# Altium schematic sheet main.SchDoc: TinyProbe Power Fix PCB
size A4; DrawnBy: Sergei Vostrikov; Organization: Integrated Systems Laboratory; Revision: v1.0.0; SheetNumber: 1; SheetTotal: 1
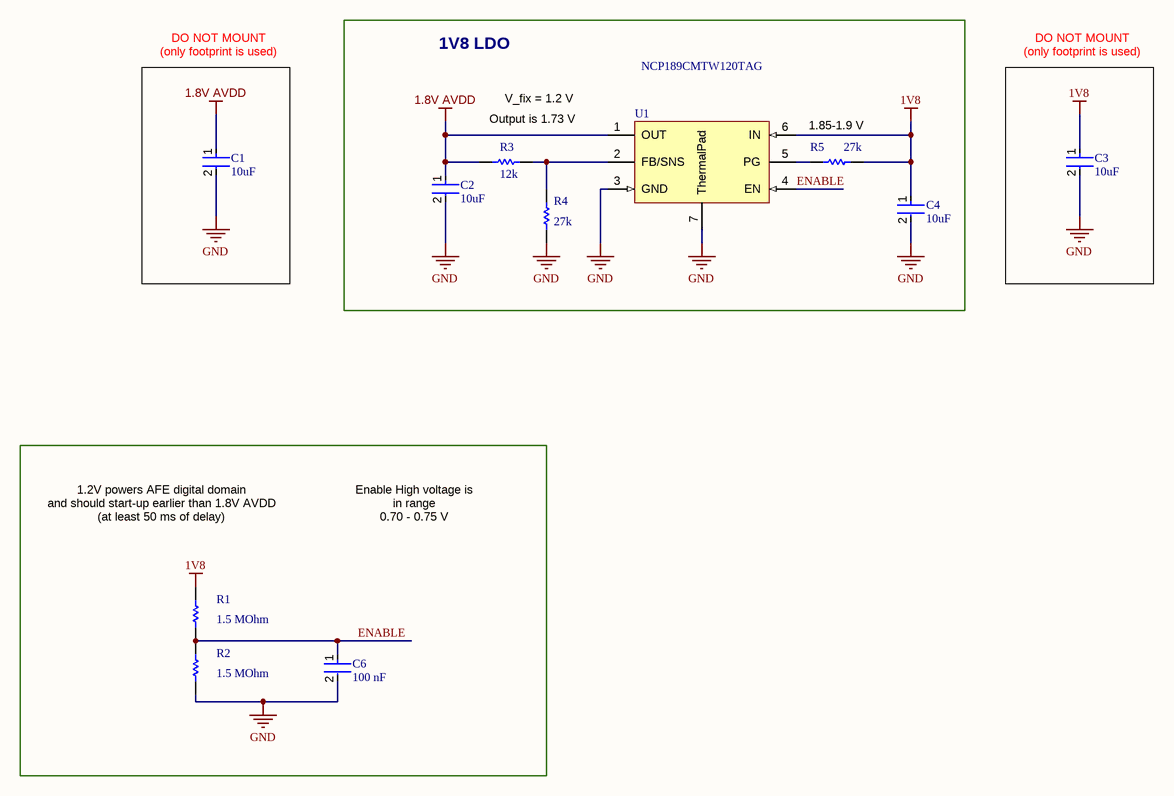
[diagram p0: main.SchDoc]

## Parts
C1  10uF  [FP-GRM188-0_1-e0_2_0_55-IPC_A]
C2  10uF  [FP-GRM188-0_1-e0_2_0_55-IPC_A]
C3  10uF  [FP-GRM188-0_1-e0_2_0_55-IPC_A]
C4  10uF  [FP-GRM188-0_1-e0_2_0_55-IPC_A]
C6  100 nF  [FP-C0402-BB-MFG]
R1  1.5 MOhm  [RESC1005X40X25NL05T10]
R2  1.5 MOhm  [RESC1005X40X25NL05T10]
R3  12k  [RESC1005X40X25LL05T05]
R4  27k  [RESC1005X40X25LL10T10]
R5  27k  [RESC1005X40X25LL10T10]
U1  NCP189CMTW120TAG  [NCP189]

## Blocks framed on the sheet
1V8 LDO: C2 C4 R3-R5 U1

## Nets
1.8V AVDD: C1.1 C2.1 R3.1 U1.1(OUT)
1V8: C3.1 C4.1 R1.2 R5.1 U1.6(IN)
GND: C1.2 C2.2 C3.2 C4.2 C6.2 R2.1 R4.1 U1.3(GND) U1.7(ThermalPad)
ENABLE: C6.1 R1.1 R2.2 U1.4(EN)
NetR3_2: R3.2 R4.2 U1.2(FB/SNS)
NetR5_2: R5.2 U1.5(PG)

## Notes on the sheet
- DO NOT MOUNT
  (only footprint is used)
- Output is 1.73 V
- V_fix = 1.2 V
- 1.85-1.9 V
- 1.2V powers AFE digital domain
  and should start-up earlier than 1.8V AVDD
  (at least 50 ms of delay)
- Enable High voltage is
  in range
  0.70 - 0.75 V
- 1
- 2
- 3
- 4
- A
- B
- C
- Project:
- D
- Date:
- Drawing number:
- Rev:
- Format:
- A4 Q
- Drawn by:
- Laboratory:
- Page
- Sheet:
- of
- File:

## Library data of the parts
C1-C4 = CMP-2006-02792-2: Chip Multilayer Ceramic Capacitors for General Purpose, 0603, 10uF, X5R, 15%, 20%, 6.3V; Packaging: Tape and Reel; Voltage Rating (DC): 6.3V; Width: 0.031inch; Termination: SMD/SMT; Dielectric: X5R; Package Quantity: 4000; Voltage Rating: 6.3V; Capacitance: 10uF; Case/Package: 0603; Min Operating Temperature: -55°C; Voltage: 6.3V; Length: 1.6mm; Thickness: 0.035inch; Lead Free: Lead Free; Depth: 0.8mm; Case Code (Imperial): 0603; Max Operating Temperature: 85°C; Material: Ceramic; Height: 0.8mm; Tolerance: 20%; Mount: Surface Mount; REACH SVHC: No SVHC; Radiation Hardening: No; Case Code (Metric): 1608
C6 = CMP-2008-02046-2: CAP CER 0.1UF 10V X5R 0402 / C0402C104K8PACTU; Manufacturer: Kemet; Material: Ceramic; Capacitance: 0.10 μF; Temperature Coefficient: 15%; Tolerance: 0.1; Value: 0.10 μF; Package: C0402-BB; Temperature: -55°C to +125°C; ComponentLink2Description: Datasheet; Temperature Characteristic: X5R; Device Class L1: Passive Components; Height: 0.55mm; Lead Free: Yes; ComponentLink2URL: https://content.kemet.com/datasheets/KEM_C1002_X7R_SMD.pdf; Device Class L2: Capacitors; Temperature Range Low: -55°C; Temperature Range High: +125°C; RoHS: TRUE; Octopart: https://octopart.com/c0402c104k8pactu-kemet-140039; Automotive: No; Mouser Description: Capacitor 100 nF 10 VDC 0402; Category: Cap; Voltage Rating: 10 V; Digikey Description: CAP CER 0.1UF 10V X5R 0402; Ipc Land Pattern Name: CAPC10050X50; Device Class L3: Ceramic Capacitors; Manufacturer Part Number: C0402C104K8PACTU
R1 R2 = CMP-2002-07106-1: RC0402FR-071M5L; Manufacturer: Yageo / Phycomp; Part Number: RC0402FR-071M5L
R3 = CMP-2002-00646-4: ERJ-2RKF1202X; Resistance: 12 KOhm; Tolerance: 1%; Voltage Rating: 50 V; Case\/Package: 0402; Power Rating: 100 mW; Length: 1 mm; PackageReference: 0402; DatasheetVersion: 04/2015; ComponentLink2Description: Datasheet; ComponentLink1URL: http://www.panasonic.com/; Pins: 2; Width: 0.5 mm; REACH SVHC: Yes; Packaging: Tape and Reel; Min Operating Temperature: -55 degC; Mounting Technology: Surface Mount; Max Operating Temperature: 155 degC; Case Code (Imperial): 0402; Height: 0.35 mm; PackageDescription: 2-Pin Surface Mount Device, Body 1 x 0.5 mm; RoHSCompliant: true; ComponentLink1Description: Manufacturer URL; Mount: Surface Mount; ComponentLink2URL: http://industrial.panasonic.com/cdbs/www-data/pdf/RDA0000/AOA0000C86.pdf; Package Quantity: 10000; Case Code (Metric): 1005; PartNumber: ERJ-2RKF1202X
R4 R5 = CMP-2002-05797-1: ERA-2AEB273X; Manufacturer: Panasonic; Part Number: ERA-2AEB273X
U1 = NCP189CMTW120TAG: LDO Regulator, 0.5 A, High / Accuracy (0.7%), Adjustable, / Low Noise, High PSRR with / Power Good